# EAGLE board EEZ CF-DIC r3B8 (EAGLE 7.2.0)
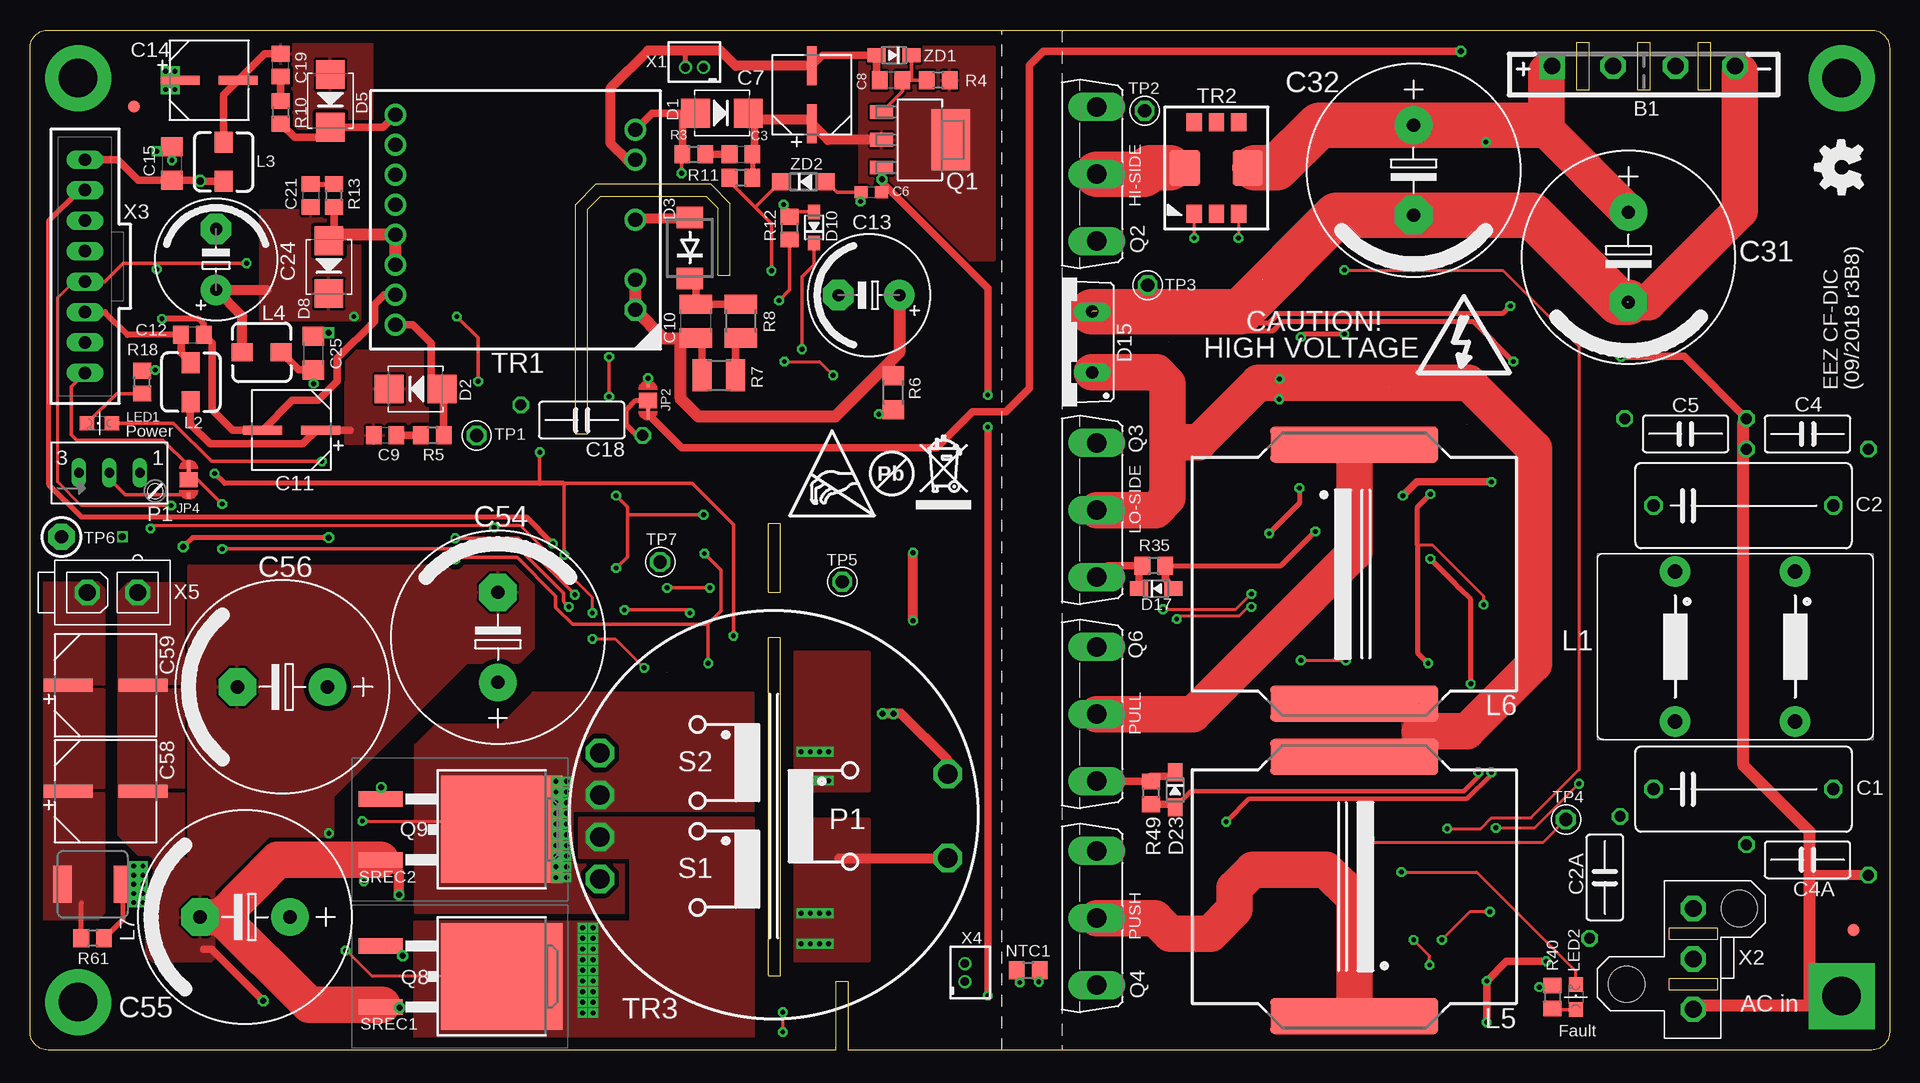
[diagram p3: board, top side]
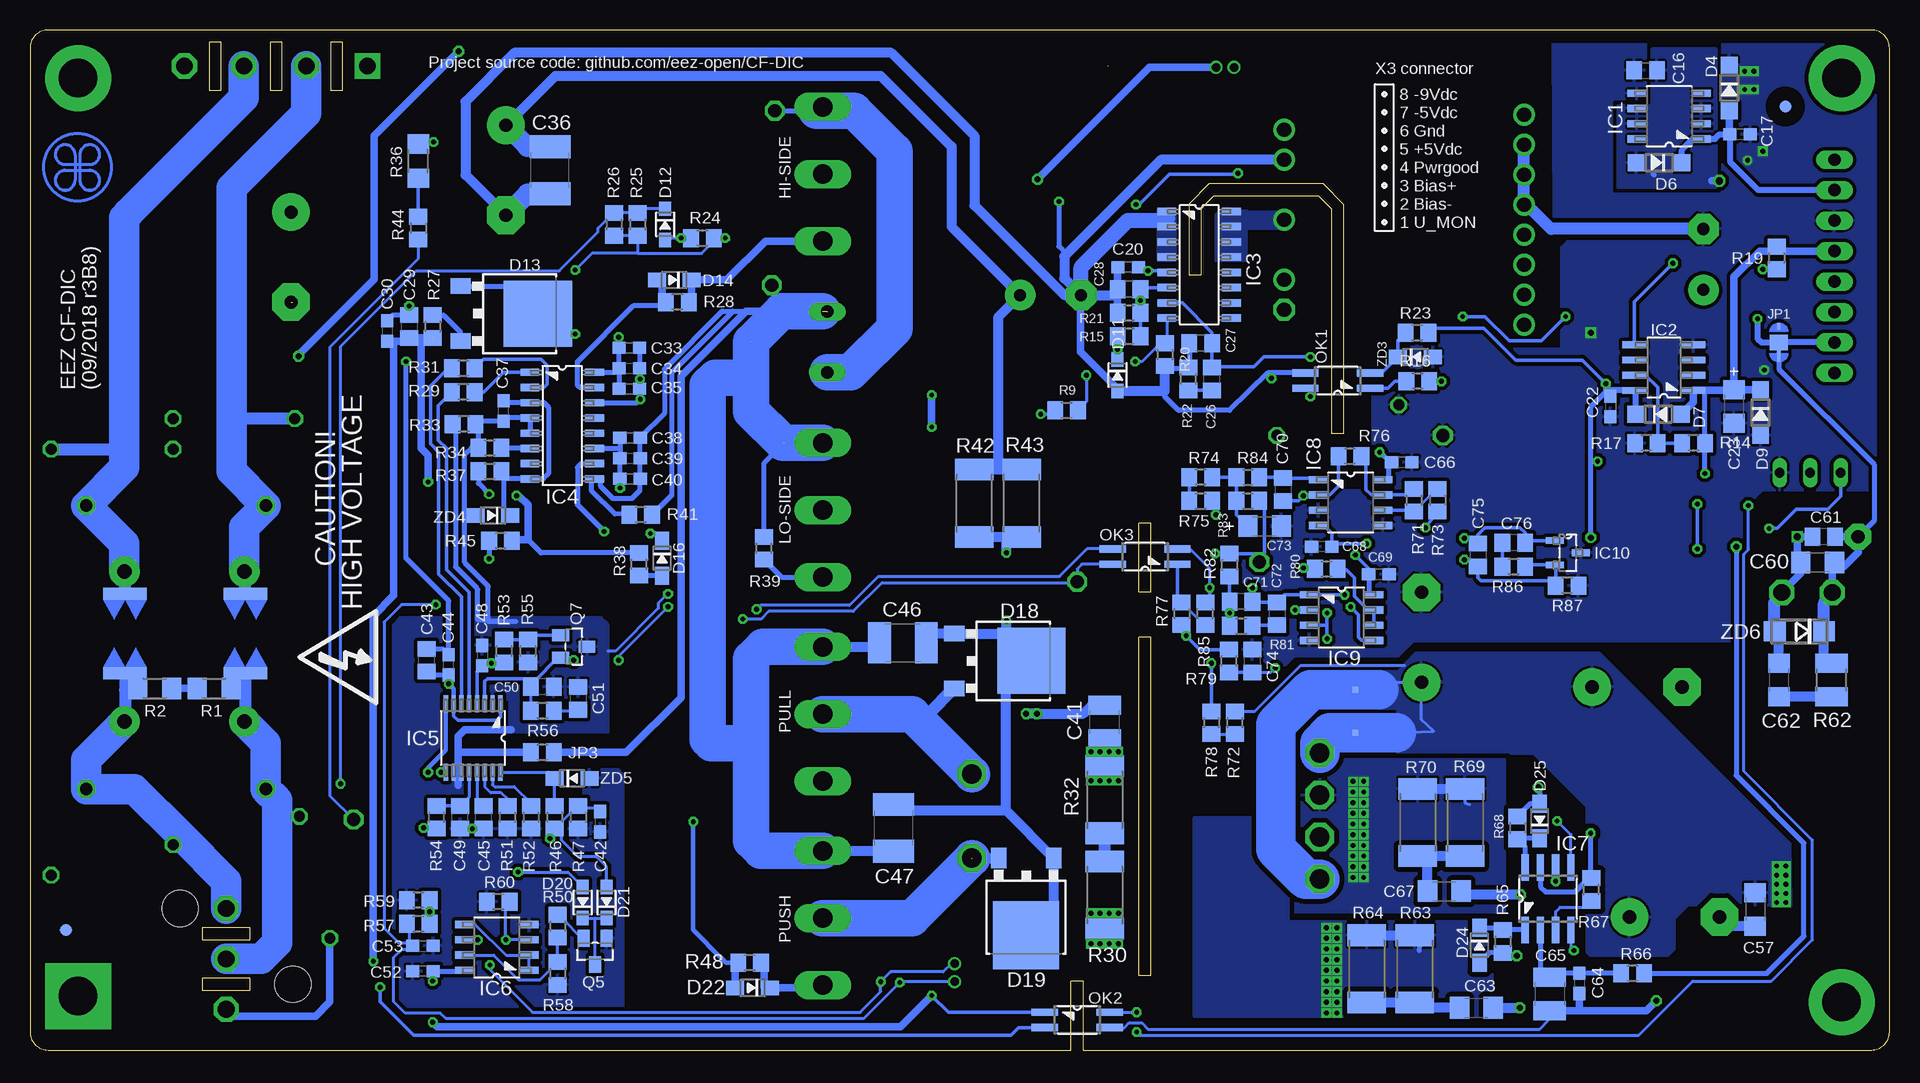
[diagram p4: board, bottom side, seen from below]

Size 155 x 85 mm. Coordinates in mm from the lower left corner, seen from the top.
Outline: 155,83.5 155,1.5 arc-90 153.5,0 68.22,0 68.22,5.75 67.2,5.75 67.2,0 1.5,0 arc-90 0,1.5 0,83.5 arc-90 1.5,85 153.5,85 arc-90 155,83.5
Outline: 62.56,38.13 62.56,43.91 61.55,43.91 61.55,38.13 62.56,38.13
Outline: 62.56,6.19 62.56,34.39 61.55,34.39 61.55,6.19 62.56,6.19
Outline: 58.37,64.55 58.37,70.52 56.72,72.17 47.2,72.17 45.48,70.45 45.48,51.34 46.5,51.34 46.5,70.07 47.58,71.15 56.34,71.15 57.36,70.14 57.36,64.55 58.37,64.55
Copper layers (1*16): Top 0.035mm / dielectric 1.5mm / Bottom 0.035mm
Design rules "default": minimum track width 6mil, minimum drill 0.3mm, track to track 6mil, track to pad 6mil, pad to pad 6mil, via to via 6mil, smd to smd 6mil, copper to edge 40mil, drill to drill 8mil, minimum pad ring 4mil, minimum via ring 8mil, stop-mask expansion 2.5mil, vias tented up to drill 0.55mm, thermal gap 8mil
Net classes: 0 default: width 0.203 mm, drill 0.3 mm, clearance 0.203 mm; 1 lvds: width 0.152 mm, drill 0.3 mm, clearance 0.152 mm to class 0, clearance 0.152 mm; 2 gnd: width 0.254 mm, drill 0.584 mm, clearance 0.254 mm

## Footprints (pad centres in the part's own frame; a part is rotated, then mirrored left to right if it is on the bottom)
GBU4K_CRE = drill 1.4 square: + -7.62,0 | drill 1.4 octagon: - 7.62,0; AC1 -2.54,0; AC2 2.667,0
C150-072X183 = drill 1.016 octagon: 1 -7.493,0; 2 7.493,0
CY075-032X103 = drill 0.914 octagon: 1 -5.08,1.27; 2 5.08,-1.27
C0805 = smd 1.3 x 1.5: 1 -0.95,0; 2 0.95,0
C0603 = smd 1.1 x 1: 1 -0.85,0; 2 0.85,0
CAPAE660X610N = smd 3.251 x 0.762: 1 -2.413,0; 2 2.413,0
C1210 = smd 1.6 x 2.7: 1 -1.4,0; 2 1.4,0
ECAP5/10.5 = drill 1.016 pad 2.54: + -2.54,0 | drill 1.016 pad 2.54 octagon: - 2.54,0
C1206 = smd 1.6 x 1.8: 1 -1.4,0; 2 1.4,0
EC1206 = smd 1.6 x 1.8: + -1.4,0; - 1.4,0
ECAP7.5/18 = drill 1.1 pad 3.14: + -3.75,0 | drill 1.1 pad 3.14 octagon: - 3.75,0
C1812 = smd 1.9 x 3.4: 1 -1.95,0; 2 1.95,0
CAPAE830X1050N = smd 4.064 x 1.092: 1 -3.124,0; 2 3.124,0
SMB = smd 2.4 x 2.4: A 2.2,0; C -2.2,0
DO214AA = smd 1.8 x 2.2: A 2.55,0; C -2.55,0
SOD123 = smd 1.4 x 1.4: A 1.9,0; C -1.9,0
SOD323-R = smd 1.2 x 1: A 1.3,0; C -1.3,0
TO252 = smd 1.3 x 1.7: 1 -2.285,-5.49; 2 2.285,-5.49 | smd 5.5 x 5.7: 3 0,0.95
SOD323-W = smd 1.5 x 1.2: A 1.45,0; C -1.45,0
TO220-2 = drill 1.016 long: 1 -2.54,-2.54; 2 2.54,-2.54
FIDUCIAL_DUAL = smd 1.016 x 1.016 bottom: B 0,0 | smd 1.016 x 1.016: T 0,0
SOIC127P600X173-8N = smd 1.55 x 0.6: 1 -2.7,1.9; 2 -2.7,0.63; 3 -2.7,-0.64; 4 -2.7,-1.91; 5 2.7,-1.91; 6 2.7,-0.64; 7 2.7,0.63; 8 2.7,1.9
SOIC127P600X175-8N = smd 1.981 x 0.559: 1 -2.464,1.905; 2 -2.464,0.635; 3 -2.464,-0.635; 4 -2.464,-1.905; 5 2.464,-1.905; 6 2.464,-0.635; 7 2.464,0.635; 8 2.464,1.905
SOIC-16 = smd 1.549 x 0.61: 1 -2.692,4.445; 2 -2.692,3.175; 3 -2.692,1.905; 4 -2.692,0.635; 5 -2.692,-0.635; 6 -2.692,-1.905; 7 -2.692,-3.175; 8 -2.692,-4.445; 9 2.692,-4.445; 10 2.692,-3.175; 11 2.692,-1.905; 12 2.692,-0.635; 13 2.692,0.635; 14 2.692,1.905; 15 2.692,3.175; 16 2.692,4.445
MTC16 = smd 1.422 x 0.356: 1 -2.845,2.275; 2 -2.845,1.625; 3 -2.845,0.975; 4 -2.845,0.325; 5 -2.845,-0.325; 6 -2.845,-0.975; 7 -2.845,-1.625; 8 -2.845,-2.275; 9 2.845,-2.275; 10 2.845,-1.625; 11 2.845,-0.975; 12 2.845,-0.325; 13 2.845,0.325; 14 2.845,0.975; 15 2.845,1.625; 16 2.845,2.275
SO8 = smd 0.6 x 2.2: 1 -1.905,-2.6; 2 -0.635,-2.6; 3 0.635,-2.6; 4 1.905,-2.6; 5 1.905,2.6; 6 0.635,2.6; 7 -0.635,2.6; 8 -1.905,2.6
SOT103P240X110-3N = smd 1.524 x 0.559: 1 -1.079,1.016; 2 -1.079,-1.016; 3 1.079,0
JP3-CUT = smd 1.27 x 1.524: COM 0,0 | smd 0.889 x 0.254: NC -1.143,0 | smd 0.508 x 0.254: NO 1.333,0
R0805 = smd 1.3 x 1.5: 1 -0.95,0; 2 0.95,0
RN214 = drill 1.2 pad 2.54: 1 -6.25,-5; 2 6.25,-5; 3 -6.25,5; 4 6.25,5
DE0403 = smd 1.5 x 1.75: 1 0,1.626; 2 0,-1.625
MURATA_6000B = smd 3 x 14: 1 -10.8,0; 2 10.8,0
IHLP-2020BZ-11 = smd 3.048 x 1.524: 1 0,2.515; 2 0,-2.515
LED_0805 = smd 1.2 x 1.2: A 0,-1.05; C 0,1.05
R_0805 = smd 1.3 x 1.5: 1 -0.95,0; 2 0.95,0
SO4 = smd 0.6 x 2.2: 1 -0.635,-2.7; 2 0.635,-2.7; 3 0.635,2.7; 4 -0.635,2.7
S64W = drill 0.813 long: A 2.54,1.27; E -2.54,1.27; S 0,1.27
SOT230P700X180-4N = smd 1.905 x 1.143: 1 -3.2,2.311; 2 -3.2,0; 3 -3.2,-2.311 | smd 3.175 x 5.08: 4 2.565,0
TO247BV = drill 1.6 long: D 0,-2.921; G -5.588,-2.921; S 5.588,-2.921
SOT23 = smd 1 x 1.4: 1 -0.95,-1.1; 2 0.95,-1.1; 3 0,1.1
SOT23-BEC = smd 1 x 1.4: B -0.95,-1.1; C 0,1.1; E 0.95,-1.1
TO263 = smd 1.3 x 3.7: 1 -2.54,-7.87; 2 2.54,-7.87 | smd 8.9 x 10.1: 3 0,2.23
R1206 = smd 1.6 x 1.803: 1 -1.422,0; 2 1.422,0
R1210 = smd 1.6 x 2.7: 1 -1.4,0; 2 1.4,0
R2512 = smd 1.8 x 3.2: 1 -2.8,0; 2 2.8,0
PCB-SAR_2.4MM = smd 3.6 x 1: 1 0,-3.3; 2 0,3.3
SHORT_NOHOLE = smd 0.5 x 0.25 bottom: P$1 0,0.117; P$2 0,-0.117
PCB_SHIELD_TAB = drill 1.1 octagon: 1 0,0
TP_1.1MM_2 = drill 0.6 square: GND 5.08,0 | drill 1.1 pad 2.184 octagon: TIP 0,0
FERYSTER_5572 = drill 1.2 octagon: 1 -10,7.5 | drill 1.2: 2 -10,5; 4 -10,0; 6 -10,-5; 7 -10,-7.5; 8 10,-8.75; 9 10,-6.25; 10 10,-3.75; 11 10,-1.25; 12 10,1.25; 13 10,3.75; 14 10,6.25; 15 10,8.75
MURATA_5300 = smd 1.27 x 1.524: 1 -1.854,-3.81; 2 0,-3.81; 3 1.854,-3.81; 4 1.854,3.81; 5 0,3.81; 6 -1.854,3.81 | smd 2.54 x 3.048: 7 2.616,0; 8 -2.616,0
VAC_DUAL_SEC = drill 1.6 octagon: P1 -14.5,3.5; P1_DOT -14.5,-3.5; S1 14.5,5.25; S1_DOT 14.5,1.75; S2 14.5,-1.75; S2_DOT 14.5,-5.25
B2B-ZR = drill 0.7 pad 1.1: 1 -0.75,0; 2 0.75,0
MINIFIT_39301039_CRE = drill 1.4 octagon: 1 0,4.2; 2 0,0; 3 0,-4.2 | hole 3: 5.55,2.1; -3.85,-4.2
70543-08 = drill 1.016 long: 1 -8.89,0; 2 -6.35,0; 3 -3.81,0; 4 -1.27,0; 5 1.27,0; 6 3.81,0; 7 6.35,0; 8 8.89,0
MINIFIT_5566-02A = drill 1.4 octagon: 1 0,2.1; 2 0,-2.1
DO214AC = smd 1.8 x 1.7: A 2.05,0; C -2.05,0

## Placement (x,y rotation side)
B1  GBU4K  [GBU4K_CRE]  134.5,82 0 top
C1  MKP-X2-220NR15/310  [C150-072X183]  142.83,21.75 0 top
C2  MKP-X2-220NR15/310  [C150-072X183]  142.83,45.37 0 top
C2A  N.C.  [CY075-032X103]  131.27,14.38 90 top
C3  1n  [C0805]  59.26,74.64 0 top
C4  CY1Y-470P  [CY075-032X103]  148.16,51.34 0 top
C4A  N.C.  [CY075-032X103]  148.16,15.84 180 top
C5  CY1Y-470P  [CY075-032X103]  138,51.34 180 top
C6  100n  [C0603]  70.12,71.47 180 top
C7  WL1E337M1012MBB  [CAPAE660X610N]  65.17,79.6 90 top
C8  470n  [C0805]  71.77,80.8 180 top
C9  3n3  [C0805]  29.61,51.21 180 top
C10  1n/1kV  [C1210]  55.52,60.74 90 top
C11  EEEFK1V470P  [CAPAE660X610N]  21.8,51.66 180 top
C12  1u  [C0805]  13.54,59.59 0 top
C13  UCY2G6R8MPD  [ECAP5/10.5]  69.93,62.9 180 top
C14  EEEFK1V470P  [CAPAE660X610N]  14.94,80.8 0 top
C15  4u7  [C1206]  11.83,73.88 270 top
C16  470n  [C0805]  20.34,81.63 0 bottom
C17  100n  [C0603]  12.46,76.3 180 bottom
C18  CY1Y-470P  [CY075-032X103]  45.99,52.48 180 top
C19  3n3  [C0805]  20.91,82.07 90 top
C20  100n  [C0603]  63.45,65.25 180 bottom
C21  3n3  [C0805]  23.38,71.22 270 top
C22  100n  [C0603]  23.26,53.63 270 bottom
C23  4u7  [EC1206]  12.97,53.63 270 bottom
C24  WL1C158M12020BB  [ECAP5/10.5]  15.51,65.88 90 top
C25  4u7  [C1206]  23.64,58.07 90 top
C26  33n  [C0805]  56.47,55.91 90 bottom
C27  2n2  [C0805]  57.42,58.9 180 bottom
C28  100p  [C0805]  63.39,63.41 180 bottom
C29  1u  [C0805]  123.4,60.29 270 bottom
C30  100n  [C0603]  125.24,59.91 270 bottom
C31  UCY2G121MHD  [ECAP7.5/18]  133.24,66.07 270 top
C32  UCY2G121MHD  [ECAP7.5/18]  115.33,73.31 270 top
C33  10n  [C0603]  105.05,58.52 0 bottom
C34  100n  [C0603]  105.05,56.8 0 bottom
C35  100n  [C0603]  105.05,55.09 0 bottom
C36  100n/500V  [C1812]  111.65,73.31 90 bottom
C37  100n  [C0603]  115.52,53.24 90 bottom
C38  10n  [C0603]  104.98,51.02 0 bottom
C39  100n  [C0603]  104.98,49.31 0 bottom
C40  100n  [C0603]  104.98,47.59 0 bottom
C41  2n2/1kV  [C1210]  65.42,27.34 90 bottom
C42  10n  [C0603]  107.46,19.02 270 bottom
C43  1u  [C0805]  121.94,32.48 90 bottom
C44  100n  [C0603]  120.09,32.1 90 bottom
C45  1u  [C0805]  117.17,19.4 90 bottom
C46  100n/500V  [C1812]  82.25,33.94 0 bottom
C47  100n/500V  [C1812]  83.01,18.51 90 bottom
C48  100n  [C0603]  117.3,32.86 270 bottom
C49  220p  [C0805]  119.14,19.4 90 bottom
C50  470p  [C0805]  112.28,30.26 180 bottom
C51  N.C.  [C0805]  109.3,29.31 270 bottom
C52  100n  [C0603]  122.25,6.57 180 bottom
C53  N.C.  [C0603]  122.25,8.67 0 bottom
C54  UPW1J152MHD  [ECAP7.5/18]  39.01,34.39 90 top
C55  UPW1J152MHD  [ECAP7.5/18]  17.92,11.08 180 top
C56  UPW1J152MHD  [ECAP7.5/18]  21.04,30.26 180 top
C57  1u/100V  [C1206]  11.19,11.72 270 bottom
C58  HHXC630ARA330MHA0G  [CAPAE830X1050N]  6.3,21.56 0 top
C59  HHXC630ARA330MHA0G  [CAPAE830X1050N]  6.3,30.38 0 top
C60  1u/100V  [C1206]  5.99,40.61 180 bottom
C61  100n/100V  [C0805]  5.48,42.77 180 bottom
C62  N.C.  [C1206]  9.22,30.83 270 bottom
C63  4n7/200V  [C1206]  34.43,3.52 0 bottom
C64  100n  [C0603]  25.86,5.56 270 bottom
C65  10u  [C1210]  28.34,4.67 270 bottom
C66  100n  [C0603]  40.66,48.99 0 bottom
C67  4n7/200V  [C1206]  37.1,13.24 0 bottom
C68  100n  [C0603]  47.32,41.94 180 bottom
C69  100n  [C0603]  42.56,39.66 0 bottom
C70  100p  [C0805]  50.56,46.7 270 bottom
C71  100p  [C0805]  54.05,37.37 180 bottom
C72  33n  [C0805]  51.07,36.35 270 bottom
C73  4u7  [EC1206]  52.09,43.66 0 bottom
C74  1u  [C0805]  53.1,32.42 90 bottom
C75  N.C.  [C0805]  34.31,41.24 270 bottom
C76  N.C.  [C0805]  31.32,42.26 180 bottom
D1  SS110B  [SMB]  57.67,78.07 180 top
D2  SS110B  [SMB]  32.15,55.09 0 top
D3  US1M-DIO  [DO214AA]  55.01,66.83 90 top
D4  SKL16  [SOD123]  13.35,80.17 270 bottom
D5  SS110B  [SMB]  25.04,79.09 90 top
D6  SKL16  [SOD123]  19.19,73.95 180 bottom
D7  SKL16  [SOD123]  19.26,52.99 0 bottom
D8  SS110B  [SMB]  24.91,65.25 90 top
D9  SKL16  [SOD123]  10.75,53.12 270 bottom
D10  BAS316  [SOD323-R]  65.36,68.55 90 top
D11  BAS316  [SOD323-R]  64.34,56.23 270 bottom
D12  BAS316  [SOD323-R]  102.06,68.8 270 bottom
D13  C3D02065E  [TO252]  113.62,61.37 270 bottom
D14  N.C.  [SOD323-W]  101.3,64.17 180 bottom
D15  C3D03060A  [TO220-2]  86,59 90 top
D16  1N5819HW-7-F  [SOD323-W]  102.31,40.99 270 bottom
D17  N.C.  [SOD323-W]  93.87,38.45 0 top
D18  C3D02065E  [TO252]  72.47,32.42 270 bottom
D19  C3D02065E  [TO252]  71.96,10.51 180 bottom
D20  BAS316  [SOD323-R]  108.92,12.29 90 bottom
D21  BAS316  [SOD323-R]  106.95,12.29 90 bottom
D22  1N5819HW-7-F  [SOD323-W]  94.76,5.18 180 bottom
D23  1N5819HW-7-F  [SOD323-W]  95.46,21.69 270 top
D24  1N5819HW-7-F  [SOD323-W]  34.18,8.73 270 bottom
D25  1N5819HW-7-F  [SOD323-W]  29.16,19.08 90 bottom
EEZ_SIGNATURE  SIGNATURESMALL  [SIGNATURE_5MM]  151.04,73.55 270 top
FM1  FIDUCIAL_2  [FIDUCIAL_DUAL]  8.68,78.63 0 top
FM2  FIDUCIAL_2  [FIDUCIAL_DUAL]  152,10 0 top
IC1  MC79L05  [SOIC127P600X173-8N]  18.37,77.82 180 bottom
IC2  LP2951SO8  [SOIC127P600X175-8N]  18.81,56.86 180 bottom
IC3  VIPER35  [SOIC-16]  57.55,65.44 0 bottom
IC4  SI8233BB-D-IS1  [SOIC-16]  110.63,52.04 0 bottom
IC5  LM5041B  [MTC16]  118.06,26 270 bottom
IC6  LM258D  [SOIC127P600X173-8N]  116.09,8.54 180 bottom
IC7  IR11688STRPBF  [SO8]  28.46,12.61 0 bottom
IC8  TL072  [SOIC127P600X173-8N]  44.91,45.62 0 bottom
IC9  TL103W  [SOIC127P600X173-8N]  45.67,36.04 0 bottom
IC10  TL431  [SOT103P240X110-3N]  26.81,41.43 0 bottom
JP1  JP3-CUT  [JP3-CUT]  9.22,58.96 90 bottom
JP2  JP3-CUT  [JP3-CUT]  51.52,54.13 90 top
JP3  0R  [R0805]  112.28,24.8 180 bottom
JP4  JP3-CUT  [JP3-CUT]  13.22,47.53 270 top
L1  RN214-2.5-02-3M3  [RN214]  142.13,33.62 270 top
L2  DLG-0403-180  [DE0403]  13.41,55.66 180 top
L3  DLG-0403-180  [DE0403]  16.15,74.01 0 top
L4  DLG-0403-180  [DE0403]  19.32,58.13 90 top
L5  60B684C  [MURATA_6000B]  110.38,13.62 90 top
L6  60B684C  [MURATA_6000B]  110.38,39.66 270 top
L7  IHLP2020CZER3R3M11  [IHLP-2020BZ-11]  5.22,13.81 270 top
LED1  LTST-C170YKT  [LED_0805]  5.79,52.23 90 top
LED2  LTST-C170KRKT  [LED_0805]  128.86,4.41 0 top
NTC1  10K/3570K  [R_0805]  83.2,6.64 0 top
OK1  TLP291-GB.SE-T  [SO4]  45.99,55.78 90 bottom
OK2  TLP291-GB.SE-T  [SO4]  67.71,2.51 270 bottom
OK3  TLP291-GB.SE-T  [SO4]  62.06,41.12 90 bottom
P1  T910W-50K  [S64W]  6.62,46.83 0 top
Q1  BCP56-16.115  [SOT230P700X180-4N]  74.18,75.85 0 top
Q2  C3M0280090D  [TO247BV]  86,73 90 top
Q3  C3M0280090D  [TO247BV]  86,45 90 top
Q4  C3M0280090D  [TO247BV]  86,11 90 top
Q5  NYC0102BLT1G  [SOT23]  107.9,8.22 180 bottom
Q6  C3M0280090D  [TO247BV]  86,28 90 top
Q7  MMBT5401  [SOT23-BEC]  109.68,33.62 270 bottom
Q8  IRFS4321PBF  [TO263]  37.1,6.13 270 top
Q9  IRFS4321PBF  [TO263]  37.1,18.38 270 top
R1  220K  [R1206]  139.65,30.13 180 bottom
R2  220K  [R1206]  144.61,30.13 180 bottom
R3  ???  [R0805]  55.33,74.64 0 top
R4  1K8  [R0805]  75.71,80.8 180 top
R5  120R  [R0805]  33.54,51.21 180 top
R6  220K  [R1206]  71.96,54.77 270 top
R7  33K  [R1210]  57.42,56.23 0 top
R8  33K  [R1210]  59.26,60.74 90 top
R9  100K  [R0805]  68.6,53.31 0 bottom
R10  120R  [R0805]  20.91,78.14 90 top
R11  33R  [R0805]  59.26,72.68 180 top
R12  ***  [R0805]  63.33,68.48 90 top
R13  120R  [R0805]  25.35,71.22 90 top
R14  16K  [R0805]  16.34,50.58 180 bottom
R15  47K  [R0805]  63.39,59.47 180 bottom
R16  750R  [R0805]  39.32,55.72 180 bottom
R17  5K1  [R0805]  20.27,50.58 180 bottom
R18  470R  [R0805]  9.35,55.66 90 top
R19  10K  [R0805]  9.41,66.01 270 bottom
R20  1K8  [R0805]  60.41,57.94 270 bottom
R21  12K  [R0805]  63.39,61.44 0 bottom
R22  47K  [R0805]  58.44,55.91 90 bottom
R23  1K  [R0805]  39.39,59.79 0 bottom
R24  10K  [R0805]  98.95,67.66 0 bottom
R25  6R2  [R0805]  104.35,68.8 270 bottom
R26  N.C.  [R0805]  106.32,68.8 270 bottom
R27  10R  [R0805]  121.43,60.29 270 bottom
R28  10R  [R0805]  101.05,62.33 180 bottom
R29  100R  [R0805]  118.89,54.83 180 bottom
R30  22R/2W  [R2512]  65.42,12.92 270 bottom
R31  100R  [R0805]  118.89,56.8 180 bottom
R32  22R/2W  [R2512]  65.42,20.86 270 bottom
R33  1R  [R0805]  118.83,52.17 180 bottom
R34  30K  [R0805]  116.67,50.2 0 bottom
R35  10R  [R0805]  93.68,40.35 180 top
R36  220K  [R1206]  122.64,74.07 270 bottom
R37  10R  [R0805]  116.67,48.23 0 bottom
R38  10R  [R0805]  104.22,40.48 90 bottom
R39  47K  [R0805]  93.81,41.81 90 bottom
R40  1K  [R0805]  126.89,4.41 270 top
R41  1R  [R0805]  104.09,44.61 180 bottom
R42  22R/2W  [R2512]  76.28,45.56 90 bottom
R43  22R/2W  [R2512]  72.34,45.56 90 bottom
R44  100K  [R0805]  122.64,68.48 270 bottom
R45  10R  [R0805]  115.78,42.45 0 bottom
R46  1K  [R0805]  111.27,19.4 270 bottom
R47  6K8  [R0805]  109.3,19.4 270 bottom
R48  22R  [R0805]  95.01,7.27 180 bottom
R49  22R  [R0805]  93.42,21.43 270 top
R50  1K  [R0805]  111.01,10.32 270 bottom
R51  30K  [R0805]  115.21,19.4 270 bottom
R52  82K  [R0805]  113.24,19.4 270 bottom
R53  6K8  [R0805]  115.46,33.24 90 bottom
R54  1K  [R0805]  121.11,19.4 90 bottom
R55  6K8  [R0805]  113.49,33.24 270 bottom
R56  N.C.  [R0805]  112.28,28.29 0 bottom
R57  3K9  [R0805]  122.64,10.51 180 bottom
R58  1K  [R0805]  111.01,6.38 270 bottom
R59  27K  [R0805]  122.64,12.48 180 bottom
R60  10K  [R0805]  115.97,12.35 180 bottom
R61  100R  [R0805]  5.22,9.3 180 top
R62  N.C.  [R1210]  4.84,30.83 90 bottom
R63  22R/3W  [R2512]  39.58,6.76 270 bottom
R64  22R/3W  [R2512]  43.58,6.76 270 bottom
R65  3R3  [R0805]  32.21,9.05 90 bottom
R66  10R  [R0805]  21.42,6.38 180 bottom
R67  47K  [R0805]  24.84,13.37 90 bottom
R68  3R3  [R0805]  31,18.51 270 bottom
R69  22R/3W  [R2512]  35.39,18.95 270 bottom
R70  22R/3W  [R2512]  39.32,18.95 270 bottom
R71  10K  [R0805]  39.64,45.82 270 bottom
R72  316K  [R0805]  54.56,27.27 90 bottom
R73  10K  [R0805]  37.67,45.82 270 bottom
R74  750R  [R0805]  57.42,47.72 180 bottom
R75  0R  [R0805]  57.42,45.75 0 bottom
R76  750R  [R0805]  44.97,49.5 0 bottom
R77  470R  [R0805]  59.01,36.35 270 bottom
R78  12K  [R0805]  56.53,27.27 270 bottom
R79  3K3  [R0805]  55.07,32.42 90 bottom
R80  750R  [R0805]  46.94,40.1 0 bottom
R81  30K  [R0805]  54.05,35.34 0 bottom
R82  10K  [R0805]  55.01,40.42 90 bottom
R83  16K  [R0805]  53.48,45.75 0 bottom
R84  220R  [R0805]  53.48,47.72 0 bottom
R85  N.C.  [R0805]  57.04,36.35 90 bottom
R86  N.C.  [R0805]  31.32,40.29 0 bottom
R87  N.C.  [R0805]  26.88,38.7 180 bottom
SAR1  PCB 2.4mm  [PCB-SAR_2.4MM]  137.05,34.7 0 bottom
SAR2  PCB 2.4mm  [PCB-SAR_2.4MM]  147.08,34.7 0 bottom
SH1  [SHORT_NOHOLE]  133.24,62.33 90 bottom
SH2  [SHORT_NOHOLE]  44.53,30 270 top
SH3  [SHORT_NOHOLE]  44.53,26.45 90 top
TP1  [PCB_SHIELD_TAB]  37.23,51.21 0 top
TP2  [PCB_SHIELD_TAB]  92.92,78.26 0 top
TP3  [PCB_SHIELD_TAB]  93.17,63.72 0 top
TP4  [PCB_SHIELD_TAB]  128.03,19.21 180 top
TP5  [PCB_SHIELD_TAB]  67.71,39.02 0 top
TP6  [TP_1.1MM_2]  2.62,42.77 0 top
TP7  [PCB_SHIELD_TAB]  52.53,40.67 0 top
TR1  Feryster 5572  [FERYSTER_5572]  40.47,69.18 180 top
TR2  53100C  [MURATA_5300]  98.89,73.5 0 top
TR3  VAC T60006-L2025-W380  [VAC_DUAL_SEC]  62,19.5 180 top
U$2  [RECYCLE_BIN1/8]  73.87,45.05 0 top
U$4  [ESD_SYMBOL]  63.3,44.52 0 top
U$5  [PB_SMALL]  71.83,48.04 180 top
X1  B2B-ZR  [B2B-ZR]  55.39,81.88 180 top
X2  39-30-1039  [MINIFIT_39301039_CRE]  138.64,7.59 180 top
X3  90136-1208  [70543-08]  4.59,65.31 90 top
X4  B2B-ZR  [B2B-ZR]  77.93,6.45 90 top
X5  39-28-1023  [MINIFIT_5566-02A]  6.87,38.13 90 top
ZD1  BZX384-C13  [SOD323-W]  72.03,82.9 180 top
ZD2  BZT52C20-DC  [SOD123]  64.47,72.36 0 top
ZD3  MMSZ5230BT1G  [SOD323-W]  39.51,57.75 0 bottom
ZD4  MMSZ5V1T1G  [SOD323-W]  116.41,44.55 180 bottom
ZD5  PDZ6.2B  [SOD323-W]  109.81,22.64 0 bottom
ZD6  SMAJ58A-TR  [DO214AC]  7.51,34.89 180 bottom

## Tracks (layer width: path | path; a pad name or v marks a point on that pad's centre or on a via)
0V  (via drill 0.4)  (6 unrouted)
  Top 0.305: C6.2 67.26,71.47 ZD2.A
  Top 0.406: D15.2 90.17,59.91 103.58,59.91 104.35,60.67 120.35,60.67 v123.65,57.37 | 88.53,61.5 89.49,60.55 103.27,60.55 104.09,61.37 122.76,61.37 v123.4,62.01 | C6.2 69.27,70.75 v69.23,70.71 | JP2.NO v51.52,55.98 | X1.2 54.64,83.27 54.63,83.28
  Top 0.61: C8.2 70.58,81.05 ZD1.A 66.06,82.9 C7.2
  Top 0.813: TR1.6 49.75,74.18 48.4,75.53 48.4,80.17 51.52,83.28 54.63,83.28 57.55,83.28 58.82,82.01 65.1,82.01
  Top 3.81: D15.2 100.89,61.54 108.92,69.56 C32.- 125.18,69.56 132.42,62.32 C31.-
  Bottom 0.406: C40.2 C39.2 C38.2 102.12,53.03 102.12,56.74 97.3,61.56 96.41,61.56 | C43.2 120.58,33.43 C44.2 120.09,37.43 123.65,40.99 v123.65,57.37 | C30.1 124.76,61.24 C29.1 v123.4,62.01 | 104.03,47.74 C40.2 | C40.2 104.16,47.57 104.16,46.64 104.86,45.94 106.38,45.94 107.46,47.02 107.46,47.47 | 107.46,47.47 107.39,47.53 | 107.46,47.47 107.58,47.59 IC4.9 108.03,47.59 108.22,47.4 108.22,46.64 106.25,44.67 R41.2 | 96.41,61.56 101.49,56.48 101.49,46.26 R41.1 | 96.41,61.56 95.33,61.56 | 88.53,61.56 91.58,61.56 93.17,63.15 TP3.1 | R39.2 93.81,48.93 92.16,50.58 | OK1.3 51.52,56.42 | 51.52,56.42 51.83,56.42 55.01,53.31 59.26,53.31 60.41,54.45 60.41,54.93 | R20.2 60.24,56.83 58.47,56.83 R22.2 58.37,56.93 C27.2 | v69.23,70.71 69.23,66.96 68.6,66.33 | 68.79,66.14 68.72,66.2 | v51.52,55.98 51.52,56.42
  Bottom 0.61: JP3.1 105.3,24.8 100.73,29.37 100.73,56.17 95.33,61.56 91.58,61.56 88.56,61.56 D15.2 | R21.1 C28.2 64.34,65.21 C20.2 | C13.- 67.45,62.33 67.45,58.2 64.34,55.09 D11.A
  Bottom 0.813: Q4.S 83.04,16.59 C47.1 | Q6.S 84.23,33.59 C46.1 | C32.- 118.7,72.93 118.7,79.03 114.63,83.09 83.2,83.09 76.28,76.17 76.28,70.39 68.79,62.9 C13.- | TR1.6 60.74,74.18 68.6,66.33 68.72,66.2 | 68.79,66.14 68.79,64.29 C13.- | C13.- 64.41,62.9 64.34,62.96 C28.2 | D11.A 60.41,54.93 R20.2
  Bottom 1.27: 98.63,26.32 98.5,26.45 | 98.31,25.3 97.87,25.3 | 97.87,25.3 97.74,25.3 97.49,25.56 98.76,26.83 | 98.31,24.86 97.87,25.3 | 60.15,69.31 60.34,69.12 63.52,69.12 67.39,65.25 C13.-
  Bottom 1.676: C36.1 113.53,71.36 C32.-
  Bottom 3.048: Q6.S 93.91,33.59 94.89,32.61 94.89,25.81 | 94.89,25.81 94.89,17.43 94.04,16.59 Q4.S | 94.89,25.81 95.14,25.56 97.49,25.56 98.19,25.56 98.5,25.88 98.5,26.45 98.5,55.4 97.87,56.04 94.89,56.04 | 94.89,59.02 94.89,56.04 | 94.89,56.04 94.89,53.24 92.23,50.59 Q3.S | 94.88,59.03 92.33,61.57 88.92,61.57
  pour Bottom (no thermals): 60.98,70.07 60.98,65.82 59.52,65.82 59.52,70.07
6VAC
  Top 0.61: R13.1 25.35,68.12 25.54,67.93
  Top 1.016: TR1.13 TR1.12 25.54,67.93 25.39,67.93 D8.A
7VAC
  Top 0.61: R10.1 22.05,76.04 24.19,76.04 D5.C 29.42,76.89 TR1.8
+2.5VREF  (via drill 0.4)  (2 unrouted)
  Top 0.254: v10.05,43.47 10.3,43.72 38.69,43.72 40.85,43.72 46.88,37.69 v46.88,36.42 | v46.88,34.26 48.78,34.26 v51.2,31.85
  Top 0.305: v38.69,43.53 38.69,43.72
  Bottom 0.254: C74.1 51.58,31.47 v51.2,31.85
  Bottom 0.305: 48.34,35.4 46.88,35.4 | 46.88,35.4 v46.88,36.42 | v46.88,34.26 46.88,35.4 | P1.E 4.08,46.13 5.16,45.05 7.76,45.05 9.35,43.47 v10.05,43.47 | R79.1 C74.1 53.48,31.85 | R73.2 v38.69,43.53
+5VREF  (via drill 0.4)
  Top 0.254: 115.65,42.07 116.92,42.07 121.17,37.81 v121.17,37.12 | v82.5,5.62 82.5,6.57 NTC1.1
  Top 0.406: v116.73,46.32 115.65,45.24 115.65,42.07 115.65,33.12 v116.54,32.23
  Bottom 0.254: v121.17,37.12 124.03,37.12 125.49,35.66 125.49,10.13 124.29,8.92 123.36,8.92 | 123.27,8.83 C53.1 | 123.36,8.92 C53.1 | C53.1 123.1,8.5 123.08,8.48 123.14,8.41 123.97,8.41 124.67,7.72 124.67,4.03 123.71,3.08 120.79,3.08 120.35,2.64 85.49,2.64 v82.5,5.62 82.43,5.7 X4.1 | 123.36,8.92 123.36,10.28 R57.2
  Bottom 0.305: IC5.4 117.74,31.57 C48.2 117.3,32.29 116.54,32.29 R53.1
  Bottom 0.406: v116.54,32.23 116.54,32.29 | R37.1 117.62,47.21 v116.73,46.32
+6V  (via drill 0.4, 0.5)
  Top 0.305: LED1.A 11.95,52.23 15.13,49.05 v24.34,49.05
  Top 0.406: v24.91,42.7 13.54,42.7 v12.78,41.94
  Top 0.508: C25.1 v23.64,55.53
  Top 0.61: C25.1 22.41,56.67 L4.2
  Bottom 0.305: R23.2 38.44,59.97 38.24,60.17 33.8,60.17 31.13,57.5 25.61,57.5 v23.64,55.53 | v24.34,49.05 24.91,49.05
  Bottom 0.406: R66.1 10.24,6.38 7.13,9.49 7.13,17.24 12.78,22.89 v12.78,41.94 | v24.91,42.7 24.91,49.05 24.91,53.59 23.64,54.86
  Bottom 0.508: v23.64,55.53 23.64,54.96 | 23.64,54.96 23.64,54.86 C22.1 | 23.64,54.96 IC2.8 21.16,54.84 D7.C
+6V_REC  (via drill 0.4)
  Top 0.305: D8.C 24.91,62.64 | v37.35,55.72 37.35,59.34 v35.58,61.12
  Top 0.813: L4.1 17.7,61.16 C24.+ 19.7,63.34
  Bottom 0.305: R16.1 v37.35,55.72 | v35.58,61.12 33.73,61.12 31.7,59.09 29.04,59.09 v27,61.12
  pour Top (isolate 0.305): 19.19,69.95 19.19,60.87 27.51,60.87 27.51,69.95
+12V  (via drill 0.4, 0.5)  (1 unrouted)
  Top 0.406: C6.1 70.97,71.68 71.3,72.01
  Top 0.61: v79.84,51.91 v79.84,4.54 | v79.84,54.58 79.84,63.47 71.3,72.01 71.01,72.3 v71.01,72.55 71.01,73.51 Q1.3 70.96,73.56 | v126.38,7.4 123.08,7.4 v121.43,5.75 v121.43,2.32 | v121.81,47.34 115.59,47.34 v114.44,46.2
  Bottom 0.305: OK2.1 78.44,3.14 v79.84,4.54
  Bottom 0.406: 123.68,59.06 C29.2 | 114.76,42.51 R45.2 | 104.22,41.81 R38.2 112.41,41.43 113.49,42.51 | v79.84,4.54 79.84,4.6 | v121.43,5.75 121.43,6.55 C52.1 118.86,6.57 IC6.8
  Bottom 0.61: 114.76,42.51 113.49,42.51 113.49,45.43 114.25,46.2 v114.44,46.2 | v121.43,2.32 121.05,1.94 82.44,1.94 v79.84,4.54 | v79.84,51.91 v79.84,54.58 | v121.81,47.34 121.81,49.56 122.38,50.13 122.38,58.96 | 122.38,58.96 122.44,59.02 | C29.2 122.38,59.34 | 122.38,59.34 R27.2 | 122.38,58.96 122.38,59.34 | 123.68,59.06 124.54,59.06 | 124.54,59.06 125.21,59.06 125.24,59.09 C30.2 125.24,59.02 | v126.38,7.4 126.38,36.16 124.67,37.88 124.67,58.94 124.54,59.06 | X1.1 61.67,81.88 v71.01,72.55
+15V
  Top 0.61: TR1.15 31.88,60.43 33.42,58.9 33.42,55.15 33.48,55.09 D2.A 34.49,55.51 R5.1
+15V_REC2
  Top 0.61: 26.69,51.66 C11.1 23.89,51.66 22.75,50.51 15,50.51 13.35,52.17 13.35,53.97 L2.1
  pour Top (isolate 0.305): 26.37,50.51 26.37,58.26 33.1,58.26 33.1,50.51
-7V_REC2
  Top 0.305: C19.2 21.1,82.84 21.23,82.84
  Top 0.61: C19.2 19.57,83.02 C14.2 16.14,79.6 L3.1
  Top 0.813: 21.22,82.84 21.23,82.84
  pour Top (isolate 0.305): 28.46,76.17 20.78,76.17 20.78,83.98 28.46,83.98
-9V  (via drill 0.6)
  Top 0.61: X3.8 7.32,74.2 9.03,72.49 C15.2 13.86,72.48 v14.18,72.42 14.34,72.39 L3.2
  Bottom 0.406: 20.91,73.95 D6.A | 19.64,72.93 19.7,72.99
  Bottom 0.61: v14.18,72.42 14.81,72.42
  pour Bottom: 22.62,71.85 22.62,78.71 19.77,78.71 19.77,83.47 14.49,83.47 14.49,71.85
-15V  (via drill 0.4)
  Top 0.508: C12.2 14.49,60.49 14.05,60.93 v11,60.93
  Top 0.61: C12.2 15.19,58.89 15.19,53.37 16.91,51.66 C11.2 21.86,54.13 24.02,54.13 25.61,55.72 25.61,57.63 28.72,60.74 28.72,62.14 29.52,62.93 TR1.14
  Bottom 0.508: v11,60.93 11,59.28 10.68,58.96 JP1.COM X3.2
AGND  (via drill 0.4)  (1 unrouted)
  Top 0.254: TR2.1 97.03,67.67 v97.04,67.66 | v109.55,64.99 109.62,64.93 122.83,64.93 129.11,58.64 129.11,23.34 125.11,19.34 121.81,19.34 120.92,18.45 v118.13,18.45 | v94.44,36.73 100.54,36.73 v101.81,38.01
  Bottom 0.254: v97.04,67.66 R24.2 98,67.4 99.01,66.39 104.35,66.39 | 104.35,66.39 R25.2 R26.2 | v118.13,18.45 118.19,18.45 | 104.35,66.39 108.16,66.39 v109.55,64.99 | v101.81,38.01 101.87,38.01 102.63,37.24 102.63,36.8 106.19,33.24 106.82,33.24 | OK3.3 66.88,41.75 69.17,39.47 84.28,39.47 86.69,37.05 94.12,37.05 v94.44,36.73
  Bottom 0.406: IC4.5 IC4.4 115.25,52.67 C37.1 117.64,52.4 R33.1 117.62,51.91 R34.1 118.19,50.2 118.76,49.63 118.76,44.55 | 114.51,35.72 116.79,35.72 116.79,38.64 118.76,40.61 118.76,44.55 | 114.7,35.72 117.68,35.85 117.68,38.39 117.77,38.52 119.52,40.27 119.52,52.1 119.59,52.17 R33.2 | ZD4.A 118.76,44.55
  Bottom 0.61: 119.33,24.8 119.33,26.13 118.76,26.7 114.89,26.7 | 119.33,24.8 119.33,24.79 | 119.33,24.79 119.33,22.07 | 119.33,24.79 118.51,24.79 JP3.2 | 119.33,24.79 119.33,24.8
  pour Bottom (isolate 0.305): 105.93,23.34 108.86,23.34 108.86,18.57 118.7,18.57 118.7,23.72 120.67,23.72 120.67,29.24 115.02,29.24 115.02,26.51 106.82,26.51 106.82,35.47 107.39,36.04 124.16,36.04 124.73,35.4 124.73,3.65 105.55,3.65 105.55,22.96
AUX_AC  (via drill 0.4)
  Top 0.305: D10.A 63.74,69.85 R12.2 63.33,69.94 v62.82,70.45 | 54.83,74.51 R3.1 54.31,74.64 v54.31,73.06
  Top 0.61: 55.45,78.64 55.45,78.1 D1.A 54.82,78.07 | 54.82,78.07 51.86,78.07 TR1.7 | R3.1 54.38,77.63 54.82,78.07
  Bottom 0.305: v62.82,70.45 62.56,70.45 60.02,72.99 54.37,72.99 v54.31,73.06
AUX_DC
  Top 0.406: C3.2 R11.1
  Top 0.61: C3.2 60.41,74.77 60.41,77.54 D1.C
  Top 0.813: 60.41,77.54 64.81,77.54 C7.1 66.5,75.85 Q1.2
  pour Top: 69.17,83.6 80.34,83.6 80.34,65.82 69.17,65.82
BUCK_OUT  (via drill 0.4)
  Top 0.305: 102.38,55.59 103.08,55.59 v104.16,55.91 | 103.46,54.45 103.52,54.52
  Top 0.406: v104.13,54.24 103.43,54.43 103.46,54.45
  Top 2.54: L6.2 115.9,28.86 115.84,28.8 115.84,26.57 115.84,24.48 115.78,24.42 L5.2
  Top 3.048: 115.84,26.57 119.78,26.57 125.37,32.16 125.37,50.13 119.9,55.59 102.38,55.59 97.42,50.64 95.14,50.64 94.82,50.32 | Q3.D 93.82,45 94.82,46.01 94.82,50.32 | 94.82,50.32 94.82,55.53 93.89,56.46 D15.1
  Bottom 0.305: C34.2 104.19,55.95 v104.16,55.91 104.19,55.87 C35.2
  Bottom 0.406: IC4.14 104.41,53.94 104.16,54.2 v104.13,54.24 C35.2 | C33.2 104.19,57.22 104.16,57.18 104.16,56.84 C34.2 | TP2.1 89.42,78.26 89.25,78.26 Q2.S
  Bottom 0.508: C33.2 104.19,58.54
  Bottom 3.048: D15.1 86.59,56.46 82.95,60.1 82.95,74.9 86.31,78.26 89.42,78.26
  pour Top (no thermals): 116.16,28.16 114.38,28.16 114.38,25.56 116.16,25.56
CLAMP_C  (via drill 0.4)
  Top 0.813: v73.61,35.78 v73.61,41.43
  Bottom 0.813: D19.3 69.68,11.85 D19.1 73.65,19.97 | D18.3 73.81,34.7 D18.1 80.09,34.7 80.15,34.64 80.15,33.71 C46.2 | C47.2 83.01,20.04 83.08,19.97 73.65,19.97 | 73.65,19.97 73.65,29.91 73.61,29.94 73.61,30.32 D18.3 | D18.3 73.61,32.41 v73.61,35.78 | v73.61,41.43 73.61,42.77 | 73.61,42.77 R43.1 | R42.1 73.62,42.76 73.61,42.77
CT_OUT  (via drill 0.4)
  Top 0.254: v122.19,18.51 125.43,18.51 v129.11,22.19
  Bottom 0.254: 121.11,18.39 R54.1 121.17,18.51 v122.19,18.51 | D12.C 104,70.1 R25.1 R26.1 106.38,69.75 107.65,68.48 107.65,68.17 110.89,64.93 122.83,64.93 129.11,58.64 v129.11,22.19
DC_BUS  (via drill 0.4)
  Top 0.254: v121.36,75.66 125.94,77.06
  Top 0.305: B1.+ 126.38,81.5 | 126.38,76.68 126.32,76.68 125.94,77.06 | R6.1 71.96,57.63 72.12,57.78
  Top 0.406: 125.94,77.44 125.94,77.06 | 50.48,64.17 TR1.2
  Top 0.61: R7.1 56.02,58.83 C10.1
  Top 1.016: 54.24,59.28 54.24,54.26 55.71,52.8 67.14,52.8 72.12,57.78 72.47,58.13 C13.+ | TR1.2 TR1.1 52.87,59.28 54.24,59.28 | 54.24,59.28 54.31,59.34 C10.1
  Top 2.54: TR2.7 102.12,73.5
  Top 3.048: 126.38,81.5 126.38,76.68 C31.+
  Top 3.81: 102.12,73.5 103.9,73.5 107.46,77.06 C32.+ 125.94,77.06
  Bottom 0.254: R36.1 v121.36,75.66
  Bottom 0.813: C32.+ 111.2,81.19 84.09,81.19 78.19,75.28 78.19,68.61 C13.+ 74.31,61.06 74.31,48.55 74.5,48.36 | R43.2 74.5,48.36 | 74.5,48.36 R42.2 77.43,48.36
  Bottom 1.676: C36.2 113.53,75.26 C32.+
DC_OUT
  Top 0.508: C12.1 8.14,59.59 6.24,61.5 X3.3
  Top 0.61: C12.1 12.59,58.11 L2.2
FB  (via drill 0.4)
  Top 0.305: v56.21,41.37 57.61,39.97 57.61,36.61 56.47,35.47 | v35.45,40.86 35.64,41.05 40.59,41.05 43.83,37.81 43.83,36.86 45.23,35.47 56.47,35.47 | v56.53,32.23 56.53,35.4 56.47,35.47
  Bottom 0.305: R82.2 | R83.2 52.09,46.13 52.09,41.37 | 52.09,41.37 52.09,41.24 TP7.1 | R86.2 30.24,40.42 IC10.2 27.83,40.35 R87.2 28.21,39.08 34.05,39.08 34.31,39.34 C75.2 34.88,40.86 v35.45,40.86 | v56.21,41.37 R82.2 | R78.1 v56.53,32.23 | R82.2 53.1,41.37 52.09,41.37
FB3
  Bottom 0.305: OK1.2 42.3,56.42 ZD3.C 40.96,59.16 R23.1
GND  (via drill 0.4, 0.5)
  Top 0.254: v27.83,14.07 28.08,16.16 27.45,15.84
  Top 0.305: v24.91,59.78 23.95,59.78 C25.2
  Top 0.406: v30.81,3.52 29.35,3.52 Q8.2 29.36,3.77 29.35,3.78 | C15.1 11.44,74.9 v10.56,74.9 | v12.08,81.57 11.64,81.06 C14.1 | 9.1,56.36 R18.2 9.42,56.67 v10.43,56.67
  Top 0.61: 14.49,8.41 15.13,8.41 v19.45,4.1
  Top 0.813: v30.75,12.92 30.75,14.83 Q9.2
  Top 3.048: 29.35,3.78 23.26,3.78 15.95,11.08 | Q9.2 27.45,15.84 20.65,15.84 15.95,11.08 | 15.95,11.08 C55.-
  Bottom 0.254: 64.22,1.87 63.77,1.87 63.39,2.25 62.31,2.25 61.8,1.75 29.16,1.75 28.4,2.51 28.4,3.2 C65.2
  Bottom 0.305: OK2.3 64.22,1.87
  Bottom 0.406: IC7.6 v27.83,14.07 | IC7.7 29.1,13.62 28.66,13.18 26.18,13.18 24.97,14.38 R67.2 24.91,14.38 v24.91,18.06 v24.91,18.07
  Bottom 0.61: 25.86,3.27 C65.2 | C64.2 25.86,3.27 | C61.2 TP6.GND 7.7,40.6 C60.2 7.39,39.72 X5.2 | 25.86,3.27 20.28,3.27 v19.45,4.1
  Bottom 0.813: C63.2 v30.81,3.52 | C57.2 13.41,10.32 C55.- | C62.1 9.22,34.56 ZD6.A | v30.75,12.92 35.38,12.92 C67.2
  Bottom 1.016: ZD6.A 9.61,34.94 9.61,37.24 X5.2 | TR1.10 TR1.9 | 30.47,72.39 TR1.11 30.22,70.43 28.21,68.42 C24.- | TR1.10 30.47,72.39 | 30.47,72.39 30.43,72.36 | TR1.10
  other vias: 12.08,80.04 11.32,80.04 11.32,81.57 11.83,74.14
  pour Top (isolate 0.406): 13.29,15.97 13.29,40.35 40.66,40.35 41.93,39.02 41.93,33.5 40.72,32.29 36.4,32.29 25.23,21.11 25.23,17.81 19.89,17.81 15.32,13.24 15.32,7.65 15.07,7.4 10.24,7.4 9.73,7.91 9.73,15.91
  pour Top (isolate 0.406, no thermals): 8.21,38.89 12.78,38.89 12.78,30.51 11,30.51 11,30 12.78,30 12.78,21.88 11,21.88 11,21.37 12.78,21.37 12.78,15.53 9.73,15.59 7.45,17.88 7.45,38.13
  pour Bottom (isolate 0.305, rank 3): 0.08,84.04 0.08,46.64 10.62,46.64 11.26,46.01 11.26,35.08 12.27,34.07 39.7,34.07 40.97,32.8 49.61,32.8 53.17,29.24 60.28,29.24 60.28,46.01 59.52,46.77 43.07,46.64 43.07,60.48 34.05,60.48 32.02,58.45 27.32,58.45 27.32,66.9 26.81,67.41 15.51,67.41 15.51,69.44 27.96,69.44 28.02,84.04
GNDA
  Top 0.305: 142.51,81.5 142.26,81.87 B1.-
  Top 3.048: SH1.P$1 134.89,62.33 142.51,69.94 142.51,81.5
HD
  Bottom 0.305: IC5.5 118.39,38.14 120.28,40.04 120.28,50.13 120.98,50.83 120.98,53.69 R29.2 119.84,54.77
HI_OUT  (1 unrouted)
  Bottom 0.406: 102.31,62.33 R28.2 102.31,62.01 104.73,62.01 109.36,57.37 109.36,55.4 109.17,55.21 IC4.15 | 102.31,64.17 D14.A
  Bottom 0.61: 102.31,62.33 102.31,64.17
HOLE_DL  (via drill 3.2 pad 5.5)
  other vias: 4,4
HOLE_UL  (via drill 3.2 pad 5.5)
  other vias: 4,81
HOLE_UR  (via drill 3.2 pad 5.5)
  other vias: 151,81
ISO_FB  (via drill 0.4)
  Top 0.254: v105.93,32.48 v109.68,32.48 | v101.81,36.92 101.55,36.92 100.79,36.16 95.84,36.16 v95.58,35.91
  Bottom 0.254: R56.1 C50.2 | Q7.E 109.87,32.67 v109.68,32.48 | v105.93,32.48 105.93,32.8 v101.81,36.92 | OK3.4 67.33,40.48 67.71,40.1 TP5.1 67.71,38.96 83.96,38.96 86.38,36.54 93.42,36.54 94.06,35.91 v95.58,35.91
  Bottom 0.305: IC5.3 117.09,30.73 116.86,30.96 113.3,30.96 | 113.3,30.96 112.73,30.96 111.22,32.46 Q7.E | C50.2 113.23,30.89 113.3,30.96
L_PULL  (via drill 0.5)
  Top 0.813: v71.07,28.04 v71.96,28.04 72.6,28.04 76.5,24.13 TR3.P1_DOT
  Top 2.54: L6.1 110.38,49.31
  Top 3.048: Q6.D 96.94,28 110.38,41.43 110.38,49.31
  Bottom 0.813: 86.66,28.04 86.69,28 | C41.2 66.5,28.74 67.2,28.04 v71.07,28.04 v71.96,28.04
  Bottom 1.016: 86.66,28.04 80.06,28.04 D18.2
  Bottom 3.048: Q6.D 86.69,28 81.5,28 TR3.P1_DOT
L_PUSH  (via drill 0.4)  (1 unrouted)
  Top 0.813: 67.45,15.97 76.53,15.97
  Top 3.048: Q4.D 93.76,11 95.08,9.68 98.38,9.68 100.41,11.72 100.41,13.49 101.93,15.02 108.03,15.02 110.38,12.67 L5.1
  Bottom 0.813: TR3.P1 73.99,16 D19.2 | R30.2 v65.04,8.86
  Bottom 3.048: Q4.D 81.5,11 TR3.P1
  other vias: 66.56,11.4 65.04,11.4 64.28,11.4 65.8,11.4 66.56,8.86 64.28,8.86 65.8,8.86
  pour Top (isolate 0.305): 69.93,7.4 63.33,7.4 63.33,19.27 69.93,19.27
LD
  Bottom 0.305: IC5.6 119.04,37.77 120.92,39.66 120.92,49.82 121.62,50.51 121.62,55.34 120.16,56.8 R31.2
LO_OUT  (via drill 0.4)
  Top 0.406: R35.1 94.63,40.73 | R35.1 94.63,40.48 | R35.1 104.28,40.35 v107.14,43.21
  Top 0.61: R35.1 94.63,39.27 D17.A
  Bottom 0.406: IC4.10 109.05,48.86 109.36,48.55 109.36,45.43 v107.14,43.21
N$1  (via drill 0.4)
  Top 0.305: v56.15,44.61 49.8,44.61 | v48.85,40.16 49.8,41.12 49.8,44.61 | 49.8,44.61 49.8,45.24 v48.85,46.2
  Bottom 0.305: R76.1 45.92,46.96 46.63,46.26 IC8.2 47.67,46.2 v48.85,46.2 49.29,45.76 C70.2 | R75.2 56.15,45.76 v56.15,44.61 | R80.1 47.96,40.16 v48.85,40.16
N$2
  Bottom 0.305: R36.2 R44.1
N$3  (via drill 0.4)
  Top 0.406: v109.55,59.66 106.19,59.66 v105.93,59.4
  Bottom 0.305: 106.21,56.48 C34.1
  Bottom 0.406: C35.1 C34.1 C33.1 105.89,59.37 v105.93,59.4 | IC4.16 106.21,56.48 | D13.1 114.95,63.66 D13.3 111.65,59.66 v109.55,59.66
N$5  (via drill 0.4)
  Bottom 0.813: R32.1 v65.8,22.45
  Bottom 1.016: C41.1 R32.1
  other vias: 66.56,22.45 65.04,22.45 64.28,22.45 64.28,24.86 66.56,24.86 65.04,24.86 65.8,24.86
  pour Top (isolate 0.305): 69.93,21.56 63.33,21.56 63.33,33.18 69.93,33.18
N$6
  Bottom 0.406: IC7.2 29.1,6.32 29.1,6.07 C65.1 28,6.41 C64.1 25.84,6.38 R66.2
N$7  (via drill 0.4)
  Top 0.254: v116.67,7.08 116.67,7.84 v115.33,9.18 | NTC1.2 84.41,6.38 84.41,6 v84.09,5.68
  Bottom 0.254: IC6.3 v115.33,9.18 115.4,9.24 115.4,11.97 R60.1 | X4.2 78.2,7.2 78.88,6.51 83.27,6.51 v84.09,5.68 84.09,4.86 85.81,3.14 113.11,3.14 116.67,6.7 v116.67,7.08
N$8
  Bottom 0.813: R62.1 C62.2
N$9
  Bottom 0.305: C72.2 53.04,35.4 R81.2
N$10  (via drill 0.4)
  Top 0.305: v49.55,36.67 54.75,36.67 v55.01,36.42
  Bottom 0.305: R82.1 C71.2 v55.01,36.42 v55.01,36.41 R81.1 | IC9.2 v49.54,36.67 v49.55,36.67
N$12
  Bottom 0.254: R78.2 R72.1
N$13
  Bottom 0.61: R48.1 93.81,7.01 93.81,5.24 93.74,5.18 D22.C 89.16,5.18 Q4.G
N$14
  Top 0.406: 93.39,22.41 R49.1
  Top 0.61: Q6.G 93.39,22.41 | R49.1 93.42,22.83 95.15,22.83 D23.C
N$15
  Bottom 1.016: C5.2 138.19,52.61 | SAR1.2 137.05,39.79 L1.1
  Bottom 2.54: L1.1 137.13,43.58 C2.1 138.19,48.23 138.19,52.61 138.19,71.85 131.96,78.08 B1.AC1
N$16
  Top 0.305: LED2.A 126.99,3.36 R40.2
N$17
  Bottom 0.305: R86.1 C76.2
N$18
  Bottom 0.254: IC7.3 27.83,11.53 27.45,11.91 25.36,11.91 R67.1
N$19
  Bottom 0.254: IC5.15 116.44,22.09 116.28,21.94 114.63,21.94 113.24,20.54 R52.1
N$21
  Bottom 0.61: R28.1 99.85,62.57 D14.C 96.93,64.17 93.68,67.41 Q2.G
N$22
  Bottom 0.254: R51.1 115.21,20.92 115.71,21.43 116.6,21.43 117.09,21.92 IC5.14
N$23
  Bottom 0.254: IC5.13 117.74,20.91 C45.2
N$24
  Bottom 1.016: C4.2 147.02,50.07 147.15,50.9 | SAR2.2 147.08,39.83 L1.3
  Bottom 2.54: L1.3 147.13,42.18 C2.2 147.15,48.55 147.15,50.9 147.15,69.37 146.96,69.56 146.67,69.85 137.17,79.35 B1.AC2
N$25
  Bottom 0.254: IC5.16 111.78,23.16 ZD5.C 111.27,22.63 R46.1
N$26  (via drill 0.4)
  Top 0.254: v121.68,11.53 120.03,11.53 v117.68,9.18
  Bottom 0.254: R57.1 v121.69,11.52 v121.68,11.53 v121.69,11.53 R59.1 | IC6.6 v117.69,9.18 v117.68,9.18
N$28
  Bottom 0.813: C2A.2 134.38,19.46
  Bottom 1.016: SAR1.1 137.05,30.13 | 137.05,30.13 137.05,27.45 L1.2 | R1.1 137.05,30.13
  Bottom 2.54: L1.2 135.34,25.58 C1.1 134.38,20.8 134.38,19.46 134.38,19.27 134.38,8.92 135.72,7.59 X2.2
N$29
  Top 0.406: 92.42,40.17 R35.2
  Top 0.61: D17.C 92.42,40.17 | R35.2 89.86,40.35 Q3.G
  Bottom 0.406: R39.1 92.35,39.41 Q3.G
N$30
  Bottom 0.61: 147.25,27.76 L1.4
  Bottom 0.813: C4A.2 143.08,17.18 142.41,17.84
  Bottom 1.016: SAR2.1 147.08,30 | 147.08,30 147.08,27.42 L1.4 | R2.2 146.96,30.13 147.08,30
  Bottom 2.54: L1.4 150.32,24.18 C1.2 146.32,21.75 142.41,17.84 138.64,14.07 X2.3
N$31
  Bottom 0.406: R27.1 120.54,61.24 119.11,59.81 D13.2
N$32  (via drill 0.4)
  Top 0.305: R40.1 125.94,5.36 v125.81,5.24
  Bottom 0.305: v125.81,5.24 125.81,4.03 123.02,1.24 73.23,1.24 72.6,1.87 OK2.2
N$33
  Bottom 0.61: R2.1 R1.2
N$35
  Bottom 0.254: R56.2 109.3,28.29 C51.2
N$36
  Bottom 0.305: IC4.1 115.52,56.48 117.17,54.83 R29.1
N$37
  Bottom 0.254: IC5.12 118.39,21.1 C49.2
  Bottom 0.305: R54.2 C49.2
N$38
  Bottom 0.254: IC6.7 116.35,7.91 114.32,5.87 112.47,5.87 R58.1 | R58.1 111.14,6.95 | R58.1 R50.2
N$40  (1 unrouted)
  Bottom 0.305: 113.3,55.21 112.16,55.21 111.9,55.47 111.9,57.05 112.41,57.56 117.18,57.56 R31.1
N$41
  Bottom 1.016: R32.2 R30.1
N$42
  Bottom 0.254: IC6.1 IC6.2 115.33,7.91 117.88,10.45 IC6.5
N$47
  Bottom 0.305: R53.2 R55.1 113.11,34.57 Q7.B
N$48
  Bottom 0.406: R34.2 113.39,50.2 IC4.6
N$50  (via drill 0.4)
  Top 0.254: TR2.3 100.74,67.67 v100.73,67.66
  Bottom 0.254: v100.73,67.66 R24.1 101.9,67.66 D12.A
N$53
  Bottom 0.305: R71.1 40.15,46.26 IC8.7 43.19,46.26 43.64,46.7 43.64,49.12 R76.2
N$54  (via drill 0.4)  (1 unrouted)
  Top 0.406: v116.73,40.93 118.76,38.89 119.21,38.45 120.09,37.56 v120.09,30.51
  Bottom 0.305: IC5.7 119.69,27.82 119.33,27.46 116.09,27.46 115.78,27.78 115.78,28.86
  Bottom 0.356: IC5.7 119.69,30.1 v120.09,30.51
  Bottom 0.406: C43.1 121.66,31.25 C44.1 v120.09,30.51 | R45.1 116.73,41.31 v116.73,40.93
N$55  (via drill 0.4)
  Top 0.406: v105.81,46.83 105.81,45.56 v103.29,43.05
  Bottom 0.406: 105.87,51.06 C38.1 105.83,50.07 | 105.83,50.07 C39.1 C40.1 105.83,46.79 v105.81,46.83 | IC4.11 105.89,50.13 105.83,50.07 | v103.29,43.05 102.92,43.05 D16.C
N$56
  Top 2.54: TR2.8 95.01,73.5
  Top 3.81: 95.01,73.5 93.36,73.5 92.86,73 Q2.D
N$57  (via drill 0.4)
  Top 0.305: v16.02,41.75 40.78,41.75 44.47,38.07 44.47,37.37 v44.91,36.92 | v16.02,45.5 13.99,47.53 JP4.COM
  Bottom 0.305: IC9.5 44.02,34.13 44.28,34.39 44.28,36.29 v44.91,36.92 | v16.02,41.75 v16.02,45.5
N$58
  Top 0.305: P1.S 6.62,47.59 7.95,46.26 13.16,46.26 JP4.NO
N$63
  Bottom 0.406: D16.A R38.1
N$64
  Bottom 0.305: R74.2 R75.1
N$66
  Bottom 0.813: C63.1 39.57,3.52 R63.2 R64.2
N$67
  Bottom 0.813: R69.2 38.56,16.16 | 38.56,16.16 R70.2 | C67.1 38.5,16.09 38.56,16.16
N$74
  Bottom 0.406: D24.C 32.39,10.18 R65.2 IC7.1
N$75
  Bottom 0.406: IC7.8 30.37,16.93 R68.2 30.93,17.63 D25.C
N$76  (via drill 0.4)
  Top 0.305: v53.1,38.51 v56.66,38.51 | v35.45,42.64 40.72,42.64 v45.42,37.94
  Bottom 0.254: C71.1 v53.1,38.51 | v56.66,38.51 56.66,40.1 58.31,41.75 OK3.2
  Bottom 0.305: IC10.1 30.18,42.45 C76.1 30.37,43.09 30.81,43.53 33.73,43.53 34.31,42.96 C75.1 34.75,42.64 v35.45,42.64 | v45.42,37.94 IC9.1 50.44,37.94 C72.1 53.04,37.3 C71.1 | v56.66,38.51 56.66,37.69 R85.2
N$87
  Bottom 0.305: R14.2 R17.1 19.32,55.22 20.34,56.23 IC2.7
N$88
  Top 0.305: R4.2 73.36,80.8 | 73.36,80.8 C8.1 72.72,79.9 Q1.1 | ZD1.C 73.47,80.92 73.36,80.8
N$89
  Bottom 0.305: OK1.1 41.8,55.15 41.23,55.72 R16.2
N$90
  Top 0.305: R18.1 7.22,54.71 LED1.C
N$91
  Top 0.61: R8.2 C10.2 55.52,64.29 55.45,64.29 D3.C
N$92  (via drill 0.4)
  Top 0.305: v48.28,54.45 v48.28,57.75
  Bottom 0.305: v48.28,54.45 48.28,55.15 OK1.4 | IC3.7 58.94,62.26 56.47,59.79 C27.1 C26.2 56.4,56.93 52.98,56.93 52.15,57.75 v48.28,57.75
N$93
  Top 0.61: R5.2 C9.1
N$94
  Top 0.61: R3.2 C3.1
N$95  (via drill 0.4)  (1 unrouted)
  Top 0.305: R12.1 63.33,63.34 v62.44,62.45
  Bottom 0.305: R15.1 R21.2 v62.44,62.45 C28.1 | IC3.6 62.31,63.53 C28.1
N$96
  Top 0.61: R7.2 58.82,58.9 R8.1
N$97
  Top 0.61: R10.2 C19.1
N$98
  Top 0.406: C21.1 R13.2
N$100
  Bottom 0.254: Q5.2 109,9.32 110.57,10.89 R50.1
N$103
  Top 0.406: JP2.COM 50.5,54.13 49.74,53.37 49.74,52.04 49.77,52.01 50.44,51.34 50.56,51.21 C18.1
N$104
  Bottom 0.305: R22.1 C26.1
N$106  (via drill 0.4)
  Top 0.305: v64.34,58.39 64.34,64.42 65.36,65.44 D10.C
  Bottom 0.305: R15.2 v64.34,58.39 64.33,58.38 D11.C
N$107  (via drill 0.4)
  Top 0.254: v62.88,57.37 65.8,57.37 v66.94,56.23
  Bottom 0.254: IC3.8 60.24,59.06 R20.1 60.79,58.89 62.31,57.37 v62.88,57.37 | v66.94,56.23 66.94,54.01 R9.2
N$108  (via drill 0.4)
  Top 0.305: 71.99,53.37 R6.2 71.61,52.99 v70.75,52.99
  Bottom 0.305: v70.75,52.99 69.86,52.99 R9.1
N$126
  Bottom 0.254: D20.C 107.9,10.99 | 107.9,10.99 D21.C | Q5.3 107.9,10.99
N$130  (via drill 0.4)
  Top 0.254: v114.32,14.83 120.6,14.83 128.86,6.57 LED2.C
  Bottom 0.254: v114.32,14.83 110.16,14.83 D20.A
N$132
  Bottom 0.254: R73.1 37.74,46.77 R71.2
  Bottom 0.305: IC8.6 39.76,44.98 R71.2
N$134
  Bottom 0.305: R84.2 50.63,47.72 C70.1 47.74,47.65 IC8.1
NFB_OFFSET
  Bottom 0.305: C73.+ 54.43,44.6 R83.1 R84.1 R74.1
OK_A
  Bottom 0.254: 57.11,35.4 R77.1
  Bottom 0.305: R85.1 57.11,35.4 | OK3.1 59.36,37.65 R77.1
PE  (via drill 0.5, 3.2 pad 5.5)
  Top 0.61: v119.27,83.22 84.47,83.22 83.33,82.07 83.33,55.15 81.36,53.18 78.57,53.18 75.58,50.2 54.31,50.2 JP2.NC | 142.83,52.36 C4.1 137.88,57.82 v132.6,57.82
  Top 0.813: C4A.1 148.35,14.57
  Top 1.016: 148.35,3.71 148.35,14.57 148.35,18.19 142.83,23.72 142.83,50.07 | 142.83,50.07 142.83,52.36 | C5.1 142.83,50.07 | 148.35,3.71 150.21,3.71 v151,4.5 | 148.35,3.71 138.95,3.71 X2.1
  Bottom 0.61: v119.27,83.22 126.32,76.17 126.32,64.23 132.6,57.94 v132.6,57.82 | C2A.1 130,4.03 131.21,2.83 138.06,2.83 138.63,3.39 X2.1
POUT+  (via drill 0.4)
  Top 0.406: R61.1 7.74,10.87 L7.1 v8.65,13.81
  Bottom 0.254: 40.4,32.04 49.1,32.04 52.91,28.22 R72.2 | 42.56,30 42.56,30.64 39.07,30.64 | 39.07,30.64 39.01,30.7 | 39.07,30.64 C54.+ 39.01,27.53 37.99,26.57 41.1,26.45
  Bottom 3.302: SH3.P$1 41.1,26.45 | SH2.P$2 42.56,30
  other vias: 8.65,14.57 8.65,13.05 8.65,15.34 8.65,12.29 9.41,12.29 9.41,13.05 9.41,13.81 9.41,14.57 9.41,15.34
  pour Bottom (isolate 0.406, rank 4): 24.15,33.05 39.51,33.05 40.97,31.53 42.56,31.53 42.56,28.48 41.04,28.48 41.04,24.73 29.67,24.73 25.23,20.29 25.23,8.16 24.97,7.91 18.43,7.91 17.92,8.41 17.92,10.95 16.78,12.1 8.21,12.1 8.27,17.18
PREG_OUT+
  Top 0.406: R61.2 4.27,12.25
  Bottom 0.406: TP6.TIP 1.29,44.1 1.29,48.8 9.22,56.74 JP1.NC
  Bottom 0.61: C61.1 TP6.TIP 2.62,41.5 3.83,40.29 C60.1 4.77,40.1 X5.1
  Bottom 0.813: R62.2 5.46,32.85 ZD6.C
  Bottom 1.016: ZD6.C 5.46,37.19 X5.1
  pour Top (isolate 0.305, no thermals): -0.17,10.95 5.67,10.95 6.18,11.46 6.18,21.37 4.91,21.37 4.91,21.88 6.18,21.88 6.18,30 4.91,30 4.91,30.51 6.18,30.51 6.18,38.39 5.67,38.89 -0.17,38.89
PULL  (via drill 0.4)
  Top 0.356: 95.39,20.23 95.46,20.16 D23.A 96.78,21.56 119.52,21.56 120.73,22.77 v120.73,23.15
  Top 0.61: R49.2 95.21,20.48 D23.A
  Bottom 0.356: v120.73,23.15 120.35,23.15 IC5.9
PUSH  (via drill 0.4)
  Top 0.356: v99.71,19.02 101.62,20.92 119.78,20.92 121.81,22.96 v121.81,23.15
  Bottom 0.356: R48.2 96.98,7.27 98.25,8.54 98.76,9.05 99.71,10 v99.71,19.02 | v121.81,23.15 121.81,23.53 120.35,24.99 120.35,28.84 IC5.8
  Bottom 0.406: R48.2 96.21,7.03
  Bottom 0.61: D22.A 96.21,7.03
PWRGOOD  (via drill 0.4)
  Top 0.254: v62.75,1.49 v62.75,3.14 | v11.76,45.37 4.27,45.37 2.3,47.34 2.3,62.71 3.64,64.04 X3.4
  Top 0.305: v18.05,65.56 10.43,65.56 | 10.43,65.56 7.76,65.56 6.24,64.04 X3.4 | v10.56,65.06 10.56,65.44 10.43,65.56
  Bottom 0.254: v62.75,1.49 62.5,1.24 20.91,1.24 16.4,5.75 9.86,5.75 6.43,9.18 6.43,17.49 12.14,23.21 12.14,41.31 11.76,41.69 v11.76,45.37 | OK2.4 v62.75,3.14
  Bottom 0.305: IC2.5 21.28,62.34 v18.05,65.56 | R19.2 v10.55,65.06 v10.56,65.06
REF
  Bottom 0.406: 115.37,53.94 IC4.3 112.16,53.94 111.78,53.56 111.78,48.04 112.22,47.59 IC4.8 115.4,47.59 115.52,47.72 115.46,47.72 | 115.37,53.94 C37.2 | 115.37,53.94 115.37,54.05 | 115.72,48.16 R37.2 115.46,47.97 115.46,47.72 | ZD4.C 114.83,44.67 115.46,44.67 115.46,47.72
S1_DOT_OUT  (via drill 0.4)
  Top 0.254: Q8.3 28.53,6.13 26.56,8.1 v26.3,8.29
  Top 0.406: Q8.3 36.3,8.38
  Bottom 0.254: IC7.4 26.56,8.54 v26.3,8.29
  Bottom 0.406: 39.2,8.29 39.08,9.62 R63.1
  Bottom 0.813: R64.1 R63.1
  other vias: 46.05,8.41 46.05,7.53 46.05,6.64 46.05,5.75 46.05,9.3 46.05,4.86 46.94,9.3 46.94,8.41 46.94,7.53 46.94,6.64 46.94,5.75 46.94,4.86 46.05,3.97 46.05,3.08 46.94,3.97 46.94,3.08 46.05,10.19 46.94,10.19
  pour Top (isolate 0.406, no thermals): 32.08,10.7 50.12,10.7 50.12,16.03 45.8,16.03 45.8,19.34 60.28,19.34 60.28,0.54 32.08,0.54
  pour Bottom (isolate 0.406): 33.1,10.7 50.12,10.7 50.12,19.34 57.99,19.34 57.99,2.83 33.1,2.83
S1_OUT
  Bottom 3.302: TR3.S1 48.65,14.25 51.13,16.73 51.13,27.15 48.28,30 SH2.P$1
S2_DOT_OUT
  Bottom 3.302: SH3.P$2 46.63,26.45 47.5,25.58 TR3.S2_DOT
S2_OUT  (via drill 0.4)
  Top 0.254: v27.7,19.08 36.24,19.08 Q9.3
  Top 0.406: 36.47,19.21 36.27,19.02
  Bottom 0.254: IC7.5 26.56,17.94 v27.7,19.08 | R69.1 35.39,20.61 35.01,20.48
  Bottom 0.813: R70.1 R69.1
  other vias: 43.83,18.83 43.83,17.94 43.83,19.72 43.83,20.61 44.72,20.61 44.72,19.72 44.72,18.83 44.72,17.94 43.83,21.5 43.83,22.38 44.72,21.5 44.72,22.38 44.72,17.05 44.72,16.16 44.72,15.27 43.83,17.05 43.83,16.16 43.83,15.27 43.83,14.38 44.72,14.38
  pour Top (isolate 0.406, rank 3, no thermals): 32.08,11.46 60.28,11.46 60.28,29.75 41.93,29.75 39.26,27.08 33.8,27.08 32.08,25.37
  pour Bottom (isolate 0.406, rank 3): 32.08,11.46 60.28,11.46 60.28,24.23 32.08,24.23
SR_OUT1  (via drill 0.5)
  Top 0.406: Q8.1 29.99,8.92 v31.07,7.84
  Bottom 0.406: D24.A 33.36,8.1 R65.1 31.95,7.84 v31.07,7.84
SR_OUT2  (via drill 0.5)
  Top 0.406: Q9.1 29.29,21.31 v29.29,21.88
  Bottom 0.406: R68.1 29.93,20.53 D25.A 29.04,20.66 v29.29,21.88
U_MON
  Top 0.305: JP4.NC 11.07,50.83 3.89,50.83 3.45,51.28 3.45,55.28 X3.1
U_MON1
  Bottom 0.305: IC9.6 IC9.7 43.45,36.67 44.59,37.81 44.59,39.34 45.29,40.03 45.93,40.03 R80.2
ULVO  (via drill 0.4)
  Top 0.254: v111.65,17.62 111.97,17.3 126.13,17.3 TP4.1
  Bottom 0.254: R46.2 109.37,20.35 R47.1 109.3,20.16 107.46,20.16 C42.1 | v111.65,17.62 111.65,18.45 R46.2 | R46.2 111.21,18.45 110.7,17.94 110.7,17.49 109.3,16.1 107.78,16.1 106.95,15.27 D21.A | R44.2 122.64,65.94 130,58.58 130,21.18 TP4.1
V+  (via drill 0.4)
  Top 0.305: 42.5,47.21 v42.5,49.82 | v58.63,34.51 58.63,43.78 55.2,47.21 44.47,47.21 44.53,47.15 v44.53,41.24
  Top 0.406: 44.47,47.21 42.5,47.21 16.21,47.21 v15.38,48.04
  Bottom 0.254: 15.39,54.83 15.26,54.96
  Bottom 0.305: R77.2 59.01,34.89 v58.63,34.51 | v58.63,34.51 58.44,34.32 | v58.63,34.51 57.48,33.37 R79.2 | R19.1 9.41,66.58 | C69.1 43.41,40.12 v44.53,41.24
  Bottom 0.406: v42.5,49.82 C66.1 41.74,48.76 41.74,47.53 41.74,47.52 IC8.8 | C69.1 43.41,37.94 IC9.8 | v15.38,48.04 R14.1 15.39,54.83
  Bottom 0.61: 5.73,66.58 X3.5 9.41,66.58 10.81,66.58 12.97,64.42 C23.+ | C23.+ 13.54,54.96 15.26,54.96 IC2.1 16.35,54 D7.A | 10.69,55.02 D9.C C23.+
V-  (via drill 0.4)
  Top 0.406: X3.7 4.14,71.66 1.54,69.06 1.54,47.15 4.27,44.42 41.35,44.42 v43.58,42.2
  Bottom 0.305: v43.58,42.2 46.22,42.2 C68.1 46.47,43.06 47.13,43.72
  Bottom 0.406: 47.64,43.68 IC8.4 47.13,43.72
  Bottom 0.508: D6.C 17.29,75.02 16.39,75.92 IC1.1 14.55,75.92 14.18,76.3 C17.2 13.31,74.03 10.94,71.66 X3.7
  Bottom 0.61: D4.A 13.35,76.33 C17.2
VIPER_D
  Top 0.406: 50.53,69.25 TR1.4
  Top 0.813: TR1.4 50.47,69.31 55.06,69.31 D3.A
  pour Bottom (isolate 0.305, no thermals): 56.4,70.2 56.4,65.82 53.61,65.82 53.61,68.48 50.18,68.48 50.18,69.82 53.61,69.82 53.61,70.2
VIPER_VDD  (via drill 0.4)
  Top 0.305: 58.31,72.61 R11.2 58.31,72.36 60.44,70.23 | v61.8,64.93 61.8,68.87 60.44,70.23 | ZD2.C 60.44,70.23
  Bottom 0.305: IC3.5 60.34,64.8 60.41,64.86 60.41,64.93 v61.8,64.93 62.28,64.93 C20.1

## Text on the board
tPlace: HI-SIDE | CAUTION! | HIGH VOLTAGE | EEZ CF-DIC | (09/2018 r3B8) | Power | LO-SIDE | PULL | SREC2 | PUSH | AC in | SREC1 | Fault
bPlace: Project source code: github.com/eez-open/CF-DIC | X3 connector | 8 -9Vdc | 7 -5Vdc | 6 Gnd | HI-SIDE | 5 +5Vdc | 4 Pwrgood | 3 Bias+ | 2 Bias- | 1 U_MON | (09/2018 r3B8) | EEZ CF-DIC | LO-SIDE | CAUTION! | HIGH VOLTAGE | PULL | PUSH
Measures: Licensed under the TAPR Open Hardware License (www.tapr.org/OHL)